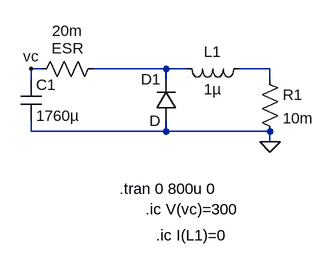
[diagram p0: schematic short_circuit.asc]
short_circuit.asc, the LTspice schematic file:
Version 4
SHEET 1 880 680
WIRE -128 112 -144 112
WIRE 64 112 -48 112
WIRE 96 112 64 112
WIRE 224 112 176 112
WIRE -144 128 -144 112
WIRE 64 128 64 112
WIRE 224 128 224 112
WIRE -144 208 -144 192
WIRE 64 208 64 192
WIRE 64 208 -144 208
WIRE 224 208 64 208
WIRE 224 224 224 208
FLAG 224 224 0
FLAG -144 112 vc
SYMBOL cap -160 128 R0
SYMATTR InstName C1
SYMATTR Value 1760µ
SYMATTR SpiceLine IC=300
SYMBOL ind 80 96 M90
WINDOW 0 5 56 VBottom 2
WINDOW 3 32 56 VTop 2
SYMATTR InstName L1
SYMATTR Value 1µ
SYMBOL res 208 112 R0
SYMATTR InstName R1
SYMATTR Value 10m
SYMBOL diode 80 192 R180
WINDOW 0 24 64 Left 2
WINDOW 3 24 0 Left 2
SYMATTR InstName D1
SYMBOL res -32 96 R90
WINDOW 0 0 56 VBottom 2
WINDOW 3 -58 56 VTop 2
SYMATTR InstName ESR
SYMATTR Value 20m
TEXT -8 296 Left 2 !.tran 0 800u 0
TEXT 32 328 Left 2 !.ic V(vc)=300
TEXT 48 368 Left 2 !.ic I(L1)=0

The netlist it stands for:
* short_circuit.asc
C1 vc 0 1760µ IC=300
L1 N001 N002 1µ
R1 N002 0 10m
D1 0 N001 D
R§ESR N001 vc 20m
.model D D
.lib standard.dio
.tran 0 800u 0
.ic V(vc)=300
.ic I(L1)=0
.backanno
.end